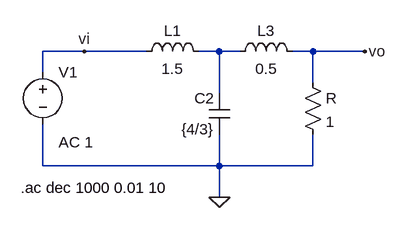
[diagram p0: schematic sim2.asc]
sim2.asc, the LTspice schematic file:
Version 4
SHEET 1 880 680
WIRE -16 144 -80 144
WIRE 80 144 -16 144
WIRE 192 144 160 144
WIRE 224 144 192 144
WIRE 336 144 304 144
WIRE 416 144 336 144
WIRE -80 176 -80 144
WIRE 336 192 336 144
WIRE 192 208 192 144
WIRE -80 320 -80 256
WIRE 192 320 192 272
WIRE 192 320 -80 320
WIRE 336 320 336 272
WIRE 336 320 192 320
WIRE 192 368 192 320
FLAG 192 368 0
FLAG 416 144 vo
FLAG -16 144 vi
SYMBOL ind 64 160 R270
WINDOW 0 32 56 VTop 2
WINDOW 3 5 56 VBottom 2
SYMATTR InstName L1
SYMATTR Value 1.5
SYMBOL cap 208 272 R180
WINDOW 0 24 56 Left 2
WINDOW 3 24 8 Left 2
SYMATTR InstName C2
SYMATTR Value {4/3}
SYMBOL ind 208 160 R270
WINDOW 0 32 56 VTop 2
WINDOW 3 5 56 VBottom 2
SYMATTR InstName L3
SYMATTR Value 0.5
SYMBOL res 320 176 R0
SYMATTR InstName R
SYMATTR Value 1
SYMBOL voltage -80 160 R0
WINDOW 123 24 124 Left 2
WINDOW 39 0 0 Left 0
SYMATTR InstName V1
SYMATTR Value ""
SYMATTR Value2 AC 1
TEXT -114 354 Left 2 !.ac dec 1000 0.01 10

The netlist it stands for:
* sim2.asc
L1 vi N001 1.5
C2 0 N001 {4/3}
L3 N001 vo 0.5
R vo 0 1
V1 vi 0 AC 1
.ac dec 1000 0.01 10
.backanno
.end